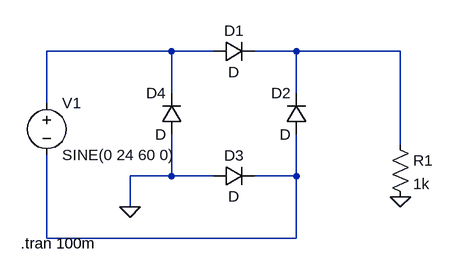
[diagram p0: schematic Bridge_Rectifier_Circuit.asc]
Bridge_Rectifier_Circuit.asc, the LTspice schematic file:
Version 4
SHEET 1 880 680
WIRE 256 0 64 0
WIRE 320 0 256 0
WIRE 448 0 384 0
WIRE 608 0 448 0
WIRE 256 64 256 0
WIRE 448 64 448 0
WIRE 64 80 64 0
WIRE 608 144 608 0
WIRE 256 192 256 128
WIRE 256 192 192 192
WIRE 320 192 256 192
WIRE 448 192 448 128
WIRE 448 192 384 192
WIRE 192 240 192 192
WIRE 64 288 64 160
WIRE 448 288 448 192
WIRE 448 288 64 288
FLAG 192 240 0
FLAG 608 224 0
SYMBOL voltage 64 64 R0
WINDOW 123 0 0 Left 0
WINDOW 39 0 0 Left 0
SYMATTR InstName V1
SYMATTR Value SINE(0 24 60 0)
SYMBOL diode 320 16 R270
WINDOW 0 32 32 VTop 2
WINDOW 3 0 32 VBottom 2
SYMATTR InstName D1
SYMBOL diode 464 128 R180
WINDOW 0 24 64 Left 2
WINDOW 3 24 0 Left 2
SYMATTR InstName D2
SYMBOL diode 320 208 R270
WINDOW 0 32 32 VTop 2
WINDOW 3 0 32 VBottom 2
SYMATTR InstName D3
SYMBOL diode 272 128 R180
WINDOW 0 24 64 Left 2
WINDOW 3 24 0 Left 2
SYMATTR InstName D4
SYMBOL res 592 128 R0
SYMATTR InstName R1
SYMATTR Value 1k
TEXT 24 296 Left 2 !.tran 100m

The netlist it stands for:
* Bridge_Rectifier_Circuit.asc
V1 N001 N003 SINE(0 24 60 0)
D1 N001 N002 D
D2 N003 N002 D
D3 0 N003 D
D4 0 N001 D
R1 N002 0 1k
.model D D
.lib standard.dio
.tran 100m
.backanno
.end